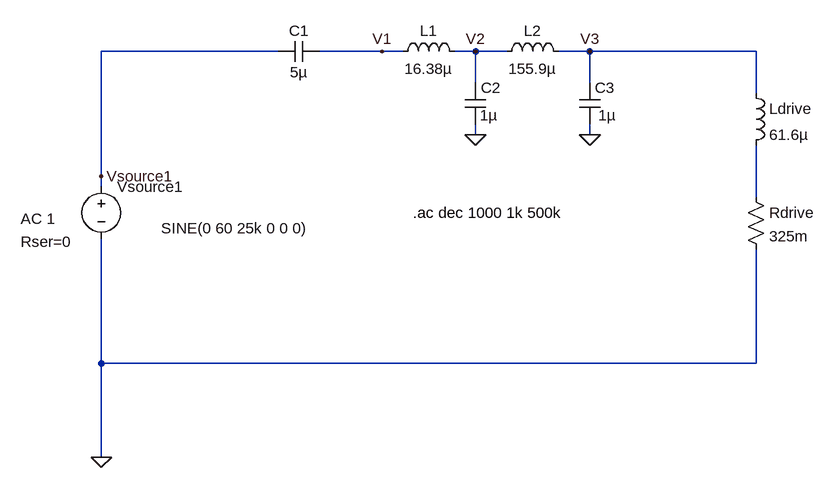
[diagram p0: schematic MPS_V0_40kHzConfig.asc]
MPS_V0_40kHzConfig.asc, the LTspice schematic file:
Version 4
SHEET 1 1748 1048
WIRE -976 -272 -1248 -272
WIRE -816 -272 -912 -272
WIRE -784 -272 -816 -272
WIRE -672 -272 -704 -272
WIRE -624 -272 -672 -272
WIRE -496 -272 -544 -272
WIRE -240 -272 -496 -272
WIRE -672 -224 -672 -272
WIRE -496 -224 -496 -272
WIRE -240 -208 -240 -272
WIRE -672 -144 -672 -160
WIRE -496 -144 -496 -160
WIRE -1248 -80 -1248 -272
WIRE -1248 -64 -1248 -80
WIRE -240 -48 -240 -128
WIRE -1248 208 -1248 16
WIRE -240 208 -240 32
WIRE -240 208 -1248 208
WIRE -1248 352 -1248 208
FLAG -1248 352 0
FLAG -1248 -80 Vsource1
FLAG -672 -144 0
FLAG -496 -144 0
FLAG -816 -272 V1
FLAG -672 -272 V2
FLAG -496 -272 V3
SYMBOL voltage -1248 -80 R0
WINDOW 123 -124 65 Left 2
WINDOW 39 -124 101 Left 2
WINDOW 3 92 80 Left 2
SYMATTR Value2 AC 1
SYMATTR SpiceLine Rser=0
SYMATTR Value SINE(0 60 25k 0 0 0)
SYMATTR InstName Vsource1
SYMBOL ind -800 -256 R270
WINDOW 0 32 56 VTop 2
WINDOW 3 5 56 VBottom 2
SYMATTR InstName L1
SYMATTR Value 16.38µ
SYMATTR SpiceLine Rser=0.075
SYMBOL cap -688 -224 R0
WINDOW 3 23 50 Left 2
SYMATTR Value 1µ
SYMATTR InstName C2
SYMBOL ind -640 -256 R270
WINDOW 0 32 56 VTop 2
WINDOW 3 5 56 VBottom 2
SYMATTR InstName L2
SYMATTR Value 155.9µ
SYMATTR SpiceLine Rser=0.26
SYMBOL cap -512 -224 R0
WINDOW 3 29 50 Left 2
SYMATTR Value 1µ
SYMATTR InstName C3
SYMBOL ind -256 -224 R0
SYMATTR InstName Ldrive
SYMATTR Value 61.6µ
SYMBOL res -256 -64 R0
SYMATTR InstName Rdrive
SYMATTR Value 325m
SYMBOL cap -912 -288 R90
WINDOW 0 0 32 VBottom 2
WINDOW 3 32 32 VTop 2
SYMATTR InstName C1
SYMATTR Value 5µ
TEXT -768 -24 Left 2 !.ac dec 1000 1k 500k

The netlist it stands for:
* MPS_V0_40kHzConfig.asc
Vsource1 Vsource1 0 SINE(0 60 25k 0 0 0) AC 1 Rser=0
L1 V1 V2 16.38µ Rser=0.075
C2 V2 0 1µ
L2 V2 V3 155.9µ Rser=0.26
C3 V3 0 1µ
Ldrive V3 N001 61.6µ
Rdrive N001 0 325m
C1 V1 Vsource1 5µ
.ac dec 1000 1k 500k
.backanno
.end